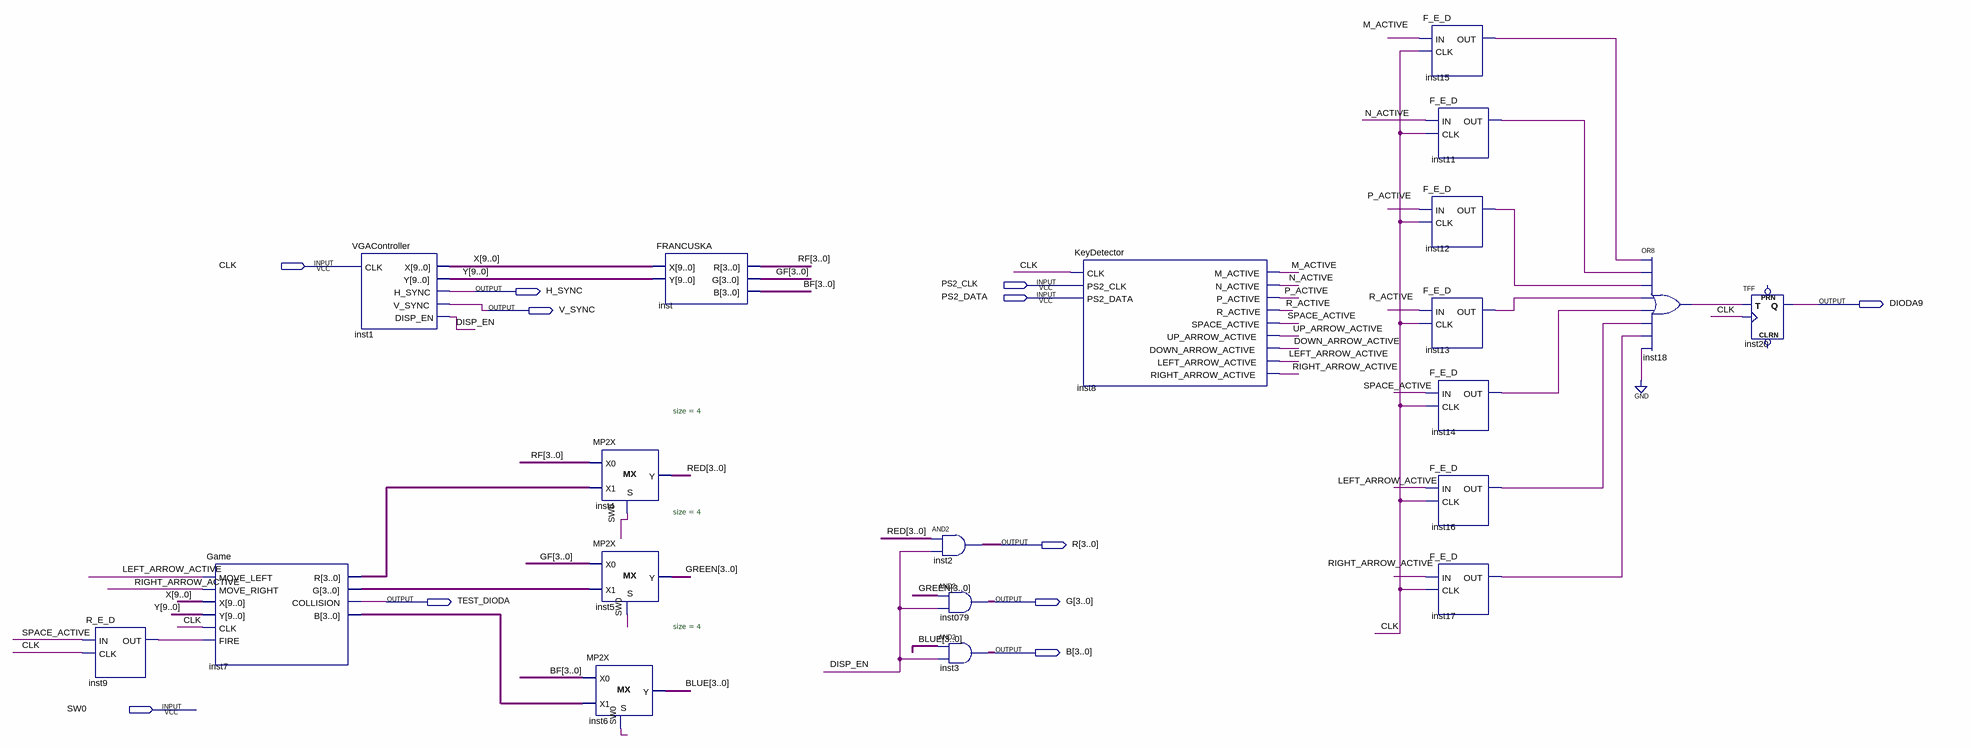
[diagram p0: schematic sheet]
// Quartus schematic Main.bdf as structural Verilog: 20 symbols, 11 pins
module Main (
  input  CLK,
  input  PS2_CLK,
  input  PS2_DATA,
  input  SW0,
  output H_SYNC,
  output DIODA9,
  output V_SYNC,
  output [3:0] R,
  output TEST_DIODA,
  output [3:0] G,
  output [3:0] B
);

  wire DISP_EN, DOWN_ARROW_ACTIVE, inst9_out, inst11_out, inst12_out, inst13_out, inst14_out, inst15_out,
       inst16_out, inst17_out, inst18_out, LEFT_ARROW_ACTIVE, M_ACTIVE, N_ACTIVE, P_ACTIVE, R_ACTIVE,
       RIGHT_ARROW_ACTIVE, SPACE_ACTIVE, UP_ARROW_ACTIVE;
  wire [3:0] BF, BLUE, GF, GREEN, inst7_b, inst7_g, inst7_r, RED, RF;
  wire [9:0] X, Y;

  R_E_D inst9 (.IN(SPACE_ACTIVE), .CLK(CLK), .OUT(inst9_out));
  Game inst7 (
    .MOVE_LEFT(LEFT_ARROW_ACTIVE), .MOVE_RIGHT(RIGHT_ARROW_ACTIVE), .X(X), .Y(Y), .CLK(CLK),
    .FIRE(inst9_out), .R(inst7_r), .G(inst7_g), .COLLISION(TEST_DIODA), .B(inst7_b));
  VGAController inst1 (.CLK(CLK), .X(X), .Y(Y), .H_SYNC(H_SYNC), .V_SYNC(V_SYNC), .DISP_EN(DISP_EN));
  MP2X #(.size(4)) inst4 (.S(SW0), .X0(RF), .X1(inst7_r), .Y(RED));
  MP2X #(.size(4)) inst5 (.S(SW0), .X0(GF), .X1(inst7_g), .Y(GREEN));
  MP2X #(.size(4)) inst6 (.S(SW0), .X0(BF), .X1(inst7_b), .Y(BLUE));
  FRANCUSKA inst (.X(X), .Y(Y), .R(RF), .G(GF), .B(BF));
  assign R = RED & {4{DISP_EN}};  // AND2 inst2, 4 bits wide
  assign G = GREEN & {4{DISP_EN}};  // AND2 inst079, 4 bits wide
  assign B = BLUE & {4{DISP_EN}};  // AND2 inst3, 4 bits wide
  KeyDetector inst8 (
    .CLK(CLK), .PS2_CLK(PS2_CLK), .PS2_DATA(PS2_DATA), .M_ACTIVE(M_ACTIVE), .N_ACTIVE(N_ACTIVE),
    .P_ACTIVE(P_ACTIVE), .R_ACTIVE(R_ACTIVE), .SPACE_ACTIVE(SPACE_ACTIVE), .UP_ARROW_ACTIVE(UP_ARROW_ACTIVE),
    .DOWN_ARROW_ACTIVE(DOWN_ARROW_ACTIVE), .LEFT_ARROW_ACTIVE(LEFT_ARROW_ACTIVE),
    .RIGHT_ARROW_ACTIVE(RIGHT_ARROW_ACTIVE));
  F_E_D inst15 (.IN(M_ACTIVE), .CLK(CLK), .OUT(inst15_out));
  F_E_D inst12 (.IN(P_ACTIVE), .CLK(CLK), .OUT(inst12_out));
  F_E_D inst13 (.IN(R_ACTIVE), .CLK(CLK), .OUT(inst13_out));
  F_E_D inst11 (.IN(N_ACTIVE), .CLK(CLK), .OUT(inst11_out));
  F_E_D inst14 (.IN(SPACE_ACTIVE), .CLK(CLK), .OUT(inst14_out));
  F_E_D inst16 (.IN(LEFT_ARROW_ACTIVE), .CLK(CLK), .OUT(inst16_out));
  F_E_D inst17 (.IN(RIGHT_ARROW_ACTIVE), .CLK(CLK), .OUT(inst17_out));
  or inst18 (inst18_out, inst15_out, inst11_out, inst12_out, inst13_out, inst14_out, inst16_out, inst17_out, 1'b0);
  TFF inst20 (.T(inst18_out), .CLK(CLK), .Q(DIODA9));  // open: PRN, CLRN
endmodule
